# EAGLE board snc98_main_cpu (EAGLE 7.7.0), part 1 of 8
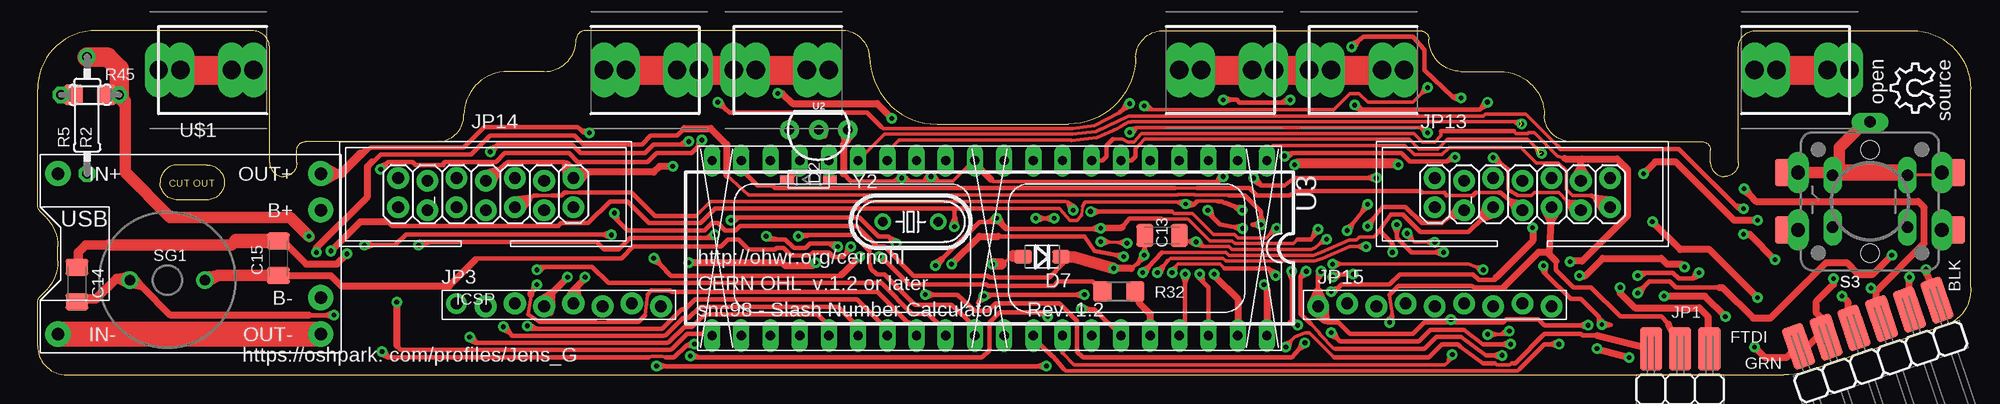
[diagram p3: board, top side]
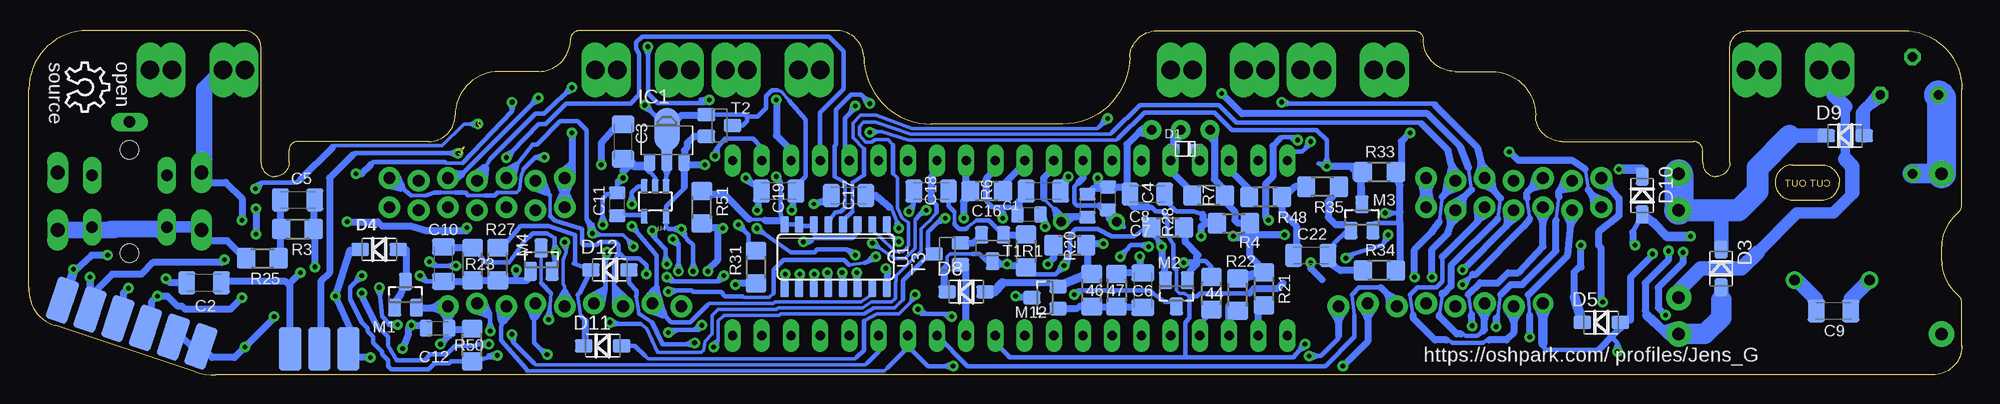
[diagram p4: board, bottom side, seen from below]

Size 168.15 x 29.97 mm. Coordinates in mm from the lower left corner, seen from the top.
Outline: 0.25,14.22 0.76,13.72 arc-42 1.78,11.18 1.78,9.91 arc-42 0.76,7.37 0.25,6.86 arc46 0,6.22 0,2.54 arc90 2.54,0 151.89,0 arc16 153.67,0.25 165.86,4.32 arc77 168.15,7.62 168.15,24.89 arc90 163.07,29.97 149.35,29.97 arc90 147.96,28.45 147.96,18.49 arc-90 146.74,17.27 arc-90 145.52,18.49 145.52,19.56 arc90 144.76,20.32 133.35,20.32 arc-90 131.06,22.61 arc90 127.25,26.42 123.83,26.42 arc-90 121.03,29.21 arc90 120.27,29.97 98.04,29.97 arc90 95.5,27.69 arc-90 89.66,21.84 78.23,21.84 arc-90 72.39,27.69 arc90 69.85,29.97 47.62,29.97 arc90 46.86,29.21 arc-90 44.07,26.42 40.89,26.42 arc90 37.08,22.61 arc-90 34.8,20.32 23.32,20.32 arc90 22.55,19.56 22.55,18.49 arc-90 21.41,17.27 arc-90 20.19,18.49 20.19,28.45 arc90 18.67,29.97 5.08,29.97 arc90 0,24.89 0,14.86
Outline: 0.25,14.22 arc-46 0,14.86
Outline: 0.25,14.22 arc-46 0,14.86
Outline: 14.73,18.29 arc-90 16.26,16.76 arc-90 14.73,15.24 12.19,15.24 arc-90 10.67,16.76 arc-90 12.19,18.29 14.73,18.29
Copper layers (1*16): Top 0.035mm / dielectric 1.5mm / Bottom 0.035mm
Design rules "OSHPark-8mil-2layer *": minimum track width 11mil, minimum drill 15mil, track to track 8mil, track to pad 8mil, pad to pad 8mil, via to via 8mil, smd to smd 8mil, copper to edge 8mil, drill to drill 8mil, minimum pad ring 12mil, minimum via ring 10mil, stop-mask expansion 4mil, vias tented up to drill 20mil, thermal gap 10mil
Net classes: 0 default: clearance 0.205 mm; 1 vcc: width 0.254 mm

## Footprints (pad centres in the part's own frame; a part is rotated, then mirrored left to right if it is on the bottom)
R1206 = smd 1.6 x 1.803: 1 -1.422,0; 2 1.422,0
BATTERY-AAA-LEFT = drill 1.6 long: P1 -2.413,0; P2 3.937,0; P3 2.032,0; P4 -4.318,0
BATTERY-AAA-RIGHT = drill 1.6 long: M1 -3.937,0; M2 2.413,0; M3 4.318,0; M4 -2.032,0
C1206K = smd 1.5 x 2: 1 -1.5,0; 2 1.5,0
C0805K = smd 1.1 x 1.4: 1 -1,0; 2 1,0
0805 = smd 1.1 x 1.4: 3 -1,0; 4 1,0
SOD-323 = smd 1 x 0.8: A -1,0; C 1,0
SOD-123 = smd 1.2 x 0.7: A 1.85,0; C -1.85,0
SOD-123F = smd 1.524 x 1.143: A 1.651,0; C -1.651,0
SOT89 = smd 1 x 1.5: 1 -1.499,-1.981; 3 1.499,-1.981 | smd 1 x 2: 2 0,-1.727 | smd 2.2 x 3.7: 2@1 0,0.94
2X3_SMD_VERTICAL = smd 1.93 x 3.81 bottom: 1 0,1.016; 3 2.54,1.016; 5 5.08,1.016 | smd 1.93 x 3.81: 4 2.54,1.016; 6 5.08,1.016; P$1 0,1.016
1X08-CLEANBIG = drill 1.016 pad 1.778: 1 -8.89,0.127 | drill 1.016 pad 1.93: 2 -6.35,-0.127; 3 -3.81,0.127; 4 -1.27,-0.127; 5 1.27,0.127; 6 3.81,-0.127; 7 6.35,0.127; 8 8.89,-0.127
1X06_LOCK = smd 1.93 x 3.81: P1 0,3.556; P2 2.54,3.556; P3 5.08,3.556; P4 7.62,3.556; P5 10.16,3.556; P6 12.7,3.556 | smd 1.93 x 3.81 bottom: P1A 0,3.556; P2A 2.54,3.556; P3A 5.08,3.556; P4A 7.62,3.556; P5A 10.16,3.556; P6A 12.7,3.556
2X07 = drill 1.016 pad 1.88: 1 -7.62,-1.143; 2 -7.62,1.397; 3 -5.08,-1.397; 4 -5.08,1.143; 5 -2.54,-1.143; 6 -2.54,1.397; 7 0,-1.397; 8 0,1.143; 9 2.54,-1.143; 10 2.54,1.397; 11 5.08,-1.397; 12 5.08,1.143; 13 7.62,-1.143; 14 7.62,1.397
1X09-BIG = drill 1.016 pad 1.88: 1 -10.16,-0.127; 2 -7.62,0.127; 3 -5.08,-0.127; 4 -2.54,0.127; 5 0,-0.127; 6 2.54,0.127; 7 5.08,-0.127; 8 7.62,0.127; 9 10.16,-0.127
SOT-23 = smd 1.143 x 1.524: 1 0.953,1.143; 2 -0.953,1.143; 3 0,-1.143
SOT-23' = smd 1.143 x 1.651: 1 0.94,1.016; 2 -0.94,1.016; 3 0.025,-1.016
0204/5 = drill 0.813 octagon: 1 -2.54,0; 2 2.54,0
0207/10 = drill 0.813 octagon: 1 -5.08,0; 2 5.08,0
TACTILE-PTH-12MM = smd 2.3 x 2.4: P$1 7.1,-2.5; P$2 -7.1,-2.5; P$3 7.1,2.5; P$4 -7.1,2.5 | drill 1.2 long: P$11 6.25,-2.5; P$12 -6.25,-2.5; P$13 6.25,2.5; P$14 -6.25,2.5 | drill 1 long: P$15 0,-6.9; P$21 3.251,-2.248; P$22 -3.251,-2.248; P$23 3.251,2.248; P$24 -3.251,2.248 | hole 1.6: 0,4.5; 0,-4.5; 0,4.5; 0,-4.5
BUZZER-12MM-NS = drill 0.9: + 3.25,0; - -3.25,0
SOT23-BEC = smd 1.143 x 1.524: B -0.953,-1.143; C 0,1.143; E 0.953,-1.143
SOT23-R_INFINEON = smd 0.8 x 0.9: 1 -1,-1.1; 2 1,-1.1; 3 0,1.1 | smd 1.143 x 1.524: B -0.95,-1.143; C 0,1.143; E 0.95,-1.143
SO16 = smd 0.711 x 1.422: 1 -4.445,-2.8; 2 -3.175,-2.8; 3 -1.905,-2.8; 4 -0.635,-2.8; 5 0.635,-2.8; 6 1.905,-2.8; 7 3.175,-2.8; 8 4.445,-2.8; 9 4.445,2.8; 10 3.175,2.8; 11 1.905,2.8; 12 0.635,2.8; 13 -0.635,2.8; 14 -1.905,2.8; 15 -3.175,2.8; 16 -4.445,2.8
TO-92-AMMO = drill 0.813 pad 1.676: 1 -2.54,0; 2 0,0; 3 2.54,0
DIP254P1524X483-40 = drill 0.813 long: 1 -15.24,48.26; 2 -15.24,45.72; 3 -15.24,43.18; 4 -15.24,40.64; 5 -15.24,38.1; 6 -15.24,35.56; 7 -15.24,33.02; 8 -15.24,30.48; 9 -15.24,27.94; 10 -15.24,25.4; 11 -15.24,22.86; 12 -15.24,20.32; 13 -15.24,17.78; 14 -15.24,15.24; 15 -15.24,12.7; 16 -15.24,10.16; 17 -15.24,7.62; 18 -15.24,5.08; 19 -15.24,2.54; 20 -15.24,0; 21 0,0; 22 0,2.54; 23 0,5.08; 24 0,7.62; 25 0,10.16; 26 0,12.7; 27 0,15.24; 28 0,17.78; 29 0,20.32; 30 0,22.86; 31 0,25.4; 32 0,27.94; 33 0,30.48; 34 0,33.02; 35 0,35.56; 36 0,38.1; 37 0,40.64; 38 0,43.18; 39 0,45.72; 40 0,48.26
SOT23-5 = smd 0.635 x 1.27: 1 -0.95,-1.3; 2 0,-1.3; 3 0.95,-1.3; 4 0.95,1.3; 5 -0.95,1.3
BATTERY-CHARGER-LI-PROT = drill 1.1 pad 2.184: B+ 10.668,3.81; B- 10.668,-3.81; IN+ -12.192,6.985; IN- -12.192,-6.985; OUT+ 10.668,6.985; OUT- 10.668,-6.985
SOT89' = smd 0.559 x 1.194: GND -1.499,-0.597; VIN 0,-0.597; VOUT 1.499,-0.597 | smd 1.829 x 0.457: P$4 0,2.743
HC49U-V = drill 0.813: 1 -2.413,0; 2 2.413,0

## Placement (x,y rotation side)
44  22k  [R1206]  65.28,7.11 270 bottom
46  47k  [R1206]  75.69,7.37 270 bottom
47  22k  [R1206]  73.53,7.37 90 bottom
BH7  HOLDER_AAA_LEFT1  [BATTERY-AAA-LEFT]  153.29,26.54 180 top
BH8  HOLDER_AAA_RIGHT  [BATTERY-AAA-RIGHT]  14.86,26.54 180 top
BH9  HOLDER_AAA_LEFT1  [BATTERY-AAA-LEFT]  114.94,26.54 0 top
BH10  HOLDER_AAA_RIGHT  [BATTERY-AAA-RIGHT]  53.21,26.54 0 top
BH11  HOLDER_AAA_LEFT1  [BATTERY-AAA-LEFT]  103.25,26.54 180 top
BH12  HOLDER_AAA_RIGHT  [BATTERY-AAA-RIGHT]  64.9,26.54 180 top
C1  220nF  [C1206K]  79.91,16 0 bottom
C2  220nF  [C1206K]  152.91,8.03 180 bottom
C3  4µ7  [C1206K]  116.46,20.32 270 bottom
C4  1µ  [C1206K]  70.87,15.75 180 bottom
C5  47n  [C1206K]  144.78,15.24 0 bottom
C6  15n  [C1206K]  71.25,7.37 90 bottom
C7  22pF  [C0805K]  76.07,14.73 90 bottom
C8  22pF  [C0805K]  74.3,15.37 90 bottom
C9  1µ  [C1206K]  11.18,5.59 180 bottom
C10  15n  [C1206K]  132.08,9.65 90 bottom
C11  1n  [0805]  116.97,14.86 90 bottom
C12  220n  [0805]  132.59,4.06 180 bottom
C13  47n  [C1206K]  97.82,12.14 180 top
C14  1µ  [C1206K]  3.43,7.87 90 top
C15  1µ  [C1206K]  20.96,10.16 90 top
C16  220nF  [0805]  81.15,13.97 0 bottom
C17  1µ  [C1206K]  96.85,15.62 180 bottom
C18  220n  [C1206K]  89.66,16 180 bottom
C19  1µ  [C1206K]  102.92,16 180 bottom
C22  15n  [C1206K]  56.64,10.41 0 bottom
D1  SD103CW  [SOD-323]  67.56,19.69 0 bottom
D2  SD103CW  [SOD-123]  67.06,17.02 0 top
D3  SD103CW  [SOD-123F]  20.96,9.27 270 bottom
D4  SD103CW  [SOD-123F]  137.67,10.92 0 bottom
D5  SD103CW  [SOD-123F]  31.37,4.57 0 bottom
D7  SD103CW  [SOD-123F]  87.38,10.29 180 top
D8  SD103CW  [SOD-123F]  86.61,7.24 0 bottom
D9  SD103CW  [SOD-123F]  10.16,20.83 0 bottom
D10  SD103CW  [SOD-123F]  27.81,15.62 270 bottom
D11  SD103CW  [SOD-123F]  118.24,2.54 0 bottom
D12  SD103CW  [SOD-123F]  117.6,9.14 0 bottom
IC1  MCP170333MB  [SOT89]  112.65,20.45 0 bottom
JP1  ICSP  [2X3_SMD_VERTICAL]  140.34,1.27 0 top
JP3  [1X08-CLEANBIG]  45.34,6.1 0 top
JP6  FTDI  [1X06_LOCK]  154.31,-0.89 18.5 top
JP13  [2X07]  129.16,15.75 0 top
JP14  [2X07]  38.99,15.75 0 top
JP15  [1X09-BIG]  121.54,6.1 0 top
LOGO1  OSHW_LOGO_8MILX0150-NT  [OSHW_8X150_NOTEXT]  164.95,27.18 270 bottom
LOGO2  OSHW_LOGO_8MILX0150-NT  [OSHW_8X150_NOTEXT]  165,22.86 90 top
M1  IRLML2244  [SOT-23]  135.38,6.98 180 bottom
M2  IRLML2244  [SOT-23]  68.33,7.11 0 bottom
M3  IRLML2244  [SOT-23]  52.2,13.72 180 bottom
M4  IRLML6244  [SOT-23']  123.57,10.03 180 bottom
M12  IRLML2244  [SOT-23]  79.76,6.73 270 bottom
R1  47k  [R1206]  81.41,10.79 90 bottom
R2  150R  [0204/5]  4.57,24.38 180 top
R3  6k8  [R1206]  144.78,12.7 180 bottom
R4  47  [R1206]  63.37,13.21 180 bottom
R5  150R  [0207/10]  4.32,22.61 270 top
R6  22k  [R1206]  84.84,16 0 bottom
R7  6k8  [R1206]  65.53,15.62 0 bottom
R20  1k  [R1206]  77.6,11.3 180 bottom
R21  6k8  [R1206]  60.71,7.49 270 bottom
R22  6k8  [R1206]  62.99,6.98 270 bottom
R23  6k8  [R1206]  129.54,9.65 270 bottom
R25  47  [R1206]  147.83,10.16 180 bottom
R27  6k8  [R1206]  127.36,9.65 270 bottom
R28  47k  [R1206]  69.09,12.83 0 bottom
R31  150  [R1206]  104.9,9.4 90 bottom
R32  150  [R1206]  94.06,7.26 0 top
R33  6k8  [R1206]  50.67,17.65 0 bottom
R34  6k8  [R1206]  50.67,9.09 0 bottom
R35  3k3  [R1206]  55.63,16.38 0 bottom
R45  150R  [R1206]  4.57,24.38 180 top
R48  3k3  [R1206]  60.58,15.49 0 bottom
R50  6k8  [R1206]  129.59,2.62 270 bottom
R51  3k3  [R1206]  109.6,14.61 270 bottom
S3  B3F-4150  [TACTILE-PTH-12MM]  159.39,15.11 180 top
SG1  SBT1205-3  [BUZZER-12MM-NS]  11.3,8.25 180 top
T1  BCR135  [SOT23-BEC]  84.33,11.05 180 bottom
T2  BCR135  [SOT23-BEC]  108.08,21.72 270 bottom
T3  BCR185  [SOT23-R_INFINEON]  88.27,10.54 90 bottom
U1  74HC4051_MUX  [SO16]  97.97,10.29 180 bottom
U2  DS18B20  [TO-92-AMMO]  67.95,21.34 180 top
U3  ATMEGA1284P-PU  [DIP254P1524X483-40]  58.67,3.43 270 top
U4  TLV70033 / TC1185  [SOT23-5]  113.67,15.11 180 bottom
U$1  BATTERY-CHARGER-LI-PROT  [BATTERY-CHARGER-LI-PROT]  13.97,10.54 0 top
U$3  HT7333 / TS9011SCY  [SOT89']  112.65,19.05 0 bottom
Y2  12MHz  [HC49U-V]  75.95,13.34 0 top

## Tracks (layer width: path | path; a pad name or v marks a point on that pad's centre or on a via)
/RESET  (via drill 0.41)
  Top 0.305: 128.25,1.02 128.07,0.89 126.87,0.89 126.75,1.02 | 108.46,2.41 109.07,3.01 | 109.07,3.01 109.37,3.3 110.26,3.68 110.62,3.68 112.78,1.52 | v108.58,2.41 108.45,2.69 109.03,2.97 108.88,2.34 v108.58,2.41 | 109.07,3.01 arc-29 108.44,2.68 | 109.07,3.01 arc29 108.88,2.33 | 109.07,3.01 arc-29 108.44,2.68 | 109.07,3.01 arc29 108.88,2.33 | 109.07,3.01 arc-29 108.44,2.68 | 109.07,3.01 arc29 108.88,2.33 | 109.07,3.01 arc-29 108.44,2.68 | 109.07,3.01 arc29 108.88,2.33 | 109.07,3.01 arc-29 108.44,2.68 | 109.07,3.01 arc29 108.88,2.33 | 109.07,3.01 arc-29 108.44,2.68 | 109.07,3.01 arc29 108.88,2.33 | 109.07,3.01 arc-29 108.44,2.68 | 109.07,3.01 arc29 108.88,2.33 | 109.07,3.01 arc-29 108.44,2.68 | 109.07,3.01 arc29 108.88,2.33 | 109.07,3.01 arc-29 108.44,2.68 | v108.58,2.41 108.44,2.68 | 109.07,3.01 arc29 108.88,2.33 | v108.58,2.41 108.88,2.33 | 109.07,3.01 arc-29 108.44,2.68 | 109.07,3.01 arc29 108.88,2.33 | 109.07,3.01 arc-29 108.44,2.68 | 109.07,3.01 arc29 108.88,2.33 | 109.07,3.01 arc-29 108.44,2.68 | 109.07,3.01 arc29 108.88,2.33 | 109.07,3.01 arc-29 108.44,2.68 | v108.58,2.41 108.44,2.68 | 109.07,3.01 arc29 108.88,2.33 | v108.58,2.41 108.88,2.33
  Top 0.406: v108.58,2.41 108.46,2.41 | 128.25,1.02 128.52,1.02 131.06,3.56 134.24,3.56 134.37,3.43 135.64,3.43 | 112.78,1.52 121.03,1.52 122.17,2.67 123.55,2.67 123.75,2.46 | 126.75,1.02 125.73,1.02 123.75,2.46 | 123.75,2.46 123.55,2.61 | v88.44,13.64 87.73,13.64 | 87.73,13.64 87.67,13.64 | 87.67,13.64 | 87.67,13.64 | 87.67,13.64 87.59,13.64 | 87.59,13.64 | 87.59,13.64 87.53,13.64 | 87.53,13.64 v86.82,13.64 | 87.73,13.64 88.35,13.4 v88.44,13.64 | 87.73,13.64 88.35,13.88 v88.44,13.64 | 87.53,13.64 86.91,13.88 v86.82,13.64 | 87.53,13.64 86.91,13.4 v86.82,13.64 | 87.67,13.64 arc-29 88.36,13.4 | 87.67,13.64 arc29 88.36,13.88 | 87.59,13.64 arc-29 86.9,13.88 | 87.59,13.64 arc29 86.9,13.4 | 87.67,13.64 arc-29 88.36,13.4 | 87.67,13.64 arc29 88.36,13.88 | 87.67,13.64 arc-29 88.36,13.4 | 87.67,13.64 arc29 88.36,13.88 | 87.67,13.64 arc-29 88.36,13.4 | 87.67,13.64 arc29 88.36,13.88 | 87.59,13.64 arc-29 86.9,13.88 | 87.59,13.64 arc29 86.9,13.4 | 87.59,13.64 arc-29 86.9,13.88 | 87.59,13.64 arc29 86.9,13.4 | 87.59,13.64 arc-29 86.9,13.88 | 87.59,13.64 arc29 86.9,13.4 | 87.67,13.64 arc-29 88.36,13.4 | 87.67,13.64 arc29 88.36,13.88 | 87.67,13.64 arc-29 88.36,13.4 | 87.67,13.64 arc29 88.36,13.88 | 87.67,13.64 arc-29 88.36,13.4 | 87.67,13.64 arc29 88.36,13.88 | 87.67,13.64 arc-29 88.36,13.4 | 87.67,13.64 arc29 88.36,13.88 | 87.67,13.64 arc-29 88.36,13.4 | 87.67,13.64 arc29 88.36,13.88 | 87.67,13.64 arc-29 88.36,13.4 | 87.67,13.64 arc29 88.36,13.88 | 87.67,13.64 arc-29 88.36,13.4 | v88.44,13.64 88.36,13.4 | 87.67,13.64 arc29 88.36,13.88 | v88.44,13.64 88.36,13.88 | 87.67,13.64 arc-29 88.36,13.4 | 87.67,13.64 arc29 88.36,13.88 | 87.67,13.64 arc-29 88.36,13.4 | v88.44,13.64 88.36,13.4
  Top 0.406: 87.67,13.64 arc29 88.36,13.88 | v88.44,13.64 88.36,13.88 | v86.82,13.64 87.01,13.8 | v86.82,13.64 86.77,13.39 | 87.59,13.64 arc-29 86.9,13.88 | 87.59,13.64 arc29 86.9,13.4 | 87.59,13.64 arc-29 86.9,13.88 | 87.59,13.64 arc29 86.9,13.4 | 87.59,13.64 arc-29 86.9,13.88 | 87.59,13.64 arc29 86.9,13.4 | 87.59,13.64 arc-29 86.9,13.88 | 87.59,13.64 arc29 86.9,13.4 | 87.59,13.64 arc-29 86.9,13.88 | 87.59,13.64 arc29 86.9,13.4 | 87.59,13.64 arc-29 86.9,13.88 | v86.82,13.64 86.9,13.88 | 87.59,13.64 arc29 86.9,13.4 | v86.82,13.64 86.9,13.4
  Top 0.61: 135.64,3.43 JP1.P$1
  Bottom 0.305: 92.1,6.58 92.84,5.84 94.61,5.84 95.5,5.33 102.74,5.33 102.87,5.21 107.7,5.21 108.2,4.7 108.2,3.08 | 108.2,3.08 | 108.2,3.08 108.2,3.01 | 108.2,3.01 108.46,2.67 | 108.2,3.01 108.28,2.38 v108.58,2.41 | 108.2,3.01 108.75,2.67 v108.58,2.41 | 108.2,3.08 arc-29 108.28,2.38 | 108.2,3.08 arc29 108.77,2.66 | 108.2,3.08 arc-29 108.28,2.38 | 108.2,3.08 arc29 108.77,2.66 | 108.2,3.08 arc-29 108.28,2.38 | 108.2,3.08 arc29 108.77,2.66 | 108.2,3.08 arc-29 108.28,2.38 | 108.2,3.08 arc29 108.77,2.66 | 108.2,3.08 arc-29 108.28,2.38 | 108.2,3.08 arc29 108.77,2.66 | 108.2,3.08 arc-29 108.28,2.38 | 108.2,3.08 arc29 108.77,2.66 | 108.2,3.08 arc-29 108.28,2.38 | 108.2,3.08 arc29 108.77,2.66 | 108.2,3.08 arc-29 108.28,2.38 | v108.58,2.41 108.28,2.38 | 108.2,3.08 arc29 108.77,2.66 | v108.58,2.41 108.77,2.66 | 108.2,3.08 arc-29 108.28,2.38 | 108.2,3.08 arc29 108.77,2.66 | 108.2,3.08 arc-29 108.28,2.38 | v108.58,2.41 108.28,2.38 | 108.2,3.08 arc29 108.77,2.66 | v108.58,2.41 108.77,2.66
  Bottom 0.406: 108.46,2.67 v108.58,2.41 | 92.1,6.58 92.1,8.23 89.92,10.41 89.53,10.41 T3.C 89.92,11.05 89.92,12.45 89.11,13.25 | 86.26,15.6 R6.1 86.26,16.54 | 89.11,13.25 89.07,13.3 | 89.07,13.3 88.72,13.64 v88.44,13.64 | 89.07,13.3 88.64,13.8 v88.44,13.64 | 89.07,13.3 88.41,13.39 v88.44,13.64 | 89.11,13.25 arc-29 88.64,13.8 | 89.11,13.25 arc29 88.39,13.39 | 89.11,13.25 arc-29 88.64,13.8 | 89.11,13.25 arc29 88.39,13.39 | 89.11,13.25 arc-29 88.64,13.8 | 89.11,13.25 arc29 88.39,13.39 | 89.11,13.25 arc-29 88.64,13.8 | 89.11,13.25 arc29 88.39,13.39 | 89.11,13.25 arc-29 88.64,13.8 | 89.11,13.25 arc29 88.39,13.39 | 89.11,13.25 arc-29 88.64,13.8 | 89.11,13.25 arc29 88.39,13.39 | 89.11,13.25 arc-29 88.64,13.8 | 89.11,13.25 arc29 88.39,13.39 | 89.11,13.25 arc-29 88.64,13.8 | 89.11,13.25 arc29 88.39,13.39 | 89.11,13.25 arc-29 88.64,13.8 | v88.44,13.64 88.64,13.8 | 89.11,13.25 arc29 88.39,13.39 | v88.44,13.64 88.39,13.39 | 89.11,13.25 arc-29 88.64,13.8 | 89.11,13.25 arc29 88.39,13.39 | 89.11,13.25 arc-29 88.64,13.8 | 89.11,13.25 arc29 88.39,13.39 | 89.11,13.25 arc-29 88.64,13.8 | 89.11,13.25 arc29 88.39,13.39 | 89.11,13.25 arc-29 88.64,13.8 | v88.44,13.64 88.64,13.8 | 89.11,13.25 arc29 88.39,13.39 | v88.44,13.64 88.39,13.39
  Bottom 0.61: 86.26,16.54 86.61,16.89 U3.9 | 86.87,13.69 v86.82,13.64 86.87,13.72 86.87,15.11 86.26,15.6
A0  (via drill 0.41)
  Top 0.61: v106.68,7.87 106.68,7.75 106.93,7.49 U3.40
  Bottom 0.61: R31.1 106.58,7.98 v106.68,7.87
A1  (via drill 0.41)
  Top 0.61: v102.36,8.76 102.36,8.64 104.39,6.6 U3.39
  Bottom 0.406: U1.9 102.36,7.44 102.36,7.99 | 102.36,7.99 | 102.36,7.99 | 102.36,7.99 102.36,8.05 | 102.36,8.05 v102.36,8.76 | 102.36,8.05 102.6,8.67 v102.36,8.76 | 102.36,8.05 102.12,8.67 v102.36,8.76 | 102.36,7.99 arc-29 102.6,8.68 | 102.36,7.99 arc29 102.12,8.68 | 102.36,7.99 arc-29 102.6,8.68 | 102.36,7.99 arc29 102.12,8.68 | 102.36,7.99 arc-29 102.6,8.68 | 102.36,7.99 arc29 102.12,8.68 | 102.36,7.99 arc-29 102.6,8.68 | 102.36,7.99 arc29 102.12,8.68 | 102.36,7.99 arc-29 102.6,8.68 | 102.36,7.99 arc29 102.12,8.68 | 102.36,7.99 arc-29 102.6,8.68 | 102.36,7.99 arc29 102.12,8.68 | 102.36,7.99 arc-29 102.6,8.68 | 102.36,7.99 arc29 102.12,8.68 | 102.36,7.99 arc-29 102.6,8.68 | 102.36,7.99 arc29 102.12,8.68 | 102.36,7.99 arc-29 102.6,8.68 | 102.36,7.99 arc29 102.12,8.68 | 102.36,7.99 arc-29 102.6,8.68 | 102.36,7.99 arc29 102.12,8.68 | 102.36,7.99 arc-29 102.6,8.68 | v102.36,8.76 102.6,8.68 | 102.36,7.99 arc29 102.12,8.68 | v102.36,8.76 102.12,8.68 | 102.36,7.99 arc-29 102.6,8.68 | 102.36,7.99 arc29 102.12,8.68 | 102.36,7.99 arc-29 102.6,8.68 | v102.36,8.76 102.6,8.68 | 102.36,7.99 arc29 102.12,8.68 | v102.36,8.76 102.12,8.68
A2  (via drill 0.41)
  Top 0.406: v101.09,8.76 101.09,8.38 101.37,8.11 | 101.37,8.11 101.41,8.06 | 101.41,8.06 101.85,7.62 U3.38 | 101.37,8.11 101.35,8.77 v101.09,8.76 | 101.37,8.11 100.91,8.59 | 100.91,8.59 | 100.91,8.59 v101.09,8.76 | 101.41,8.06 arc-29 101.34,8.79 | 101.41,8.06 arc29 100.91,8.59 | 101.41,8.06 arc-29 101.34,8.79 | 101.41,8.06 arc29 100.91,8.59 | 101.41,8.06 arc-29 101.34,8.79 | 101.41,8.06 arc29 100.91,8.59 | 101.41,8.06 arc-29 101.34,8.79 | 101.41,8.06 arc29 100.91,8.59 | 101.41,8.06 arc-29 101.34,8.79 | 101.41,8.06 arc29 100.91,8.59 | 101.41,8.06 arc-29 101.34,8.79 | 101.41,8.06 arc29 100.91,8.59 | 101.41,8.06 arc-29 101.34,8.79 | 101.41,8.06 arc29 100.91,8.59 | 101.41,8.06 arc-29 101.34,8.79 | 101.41,8.06 arc29 100.91,8.59 | 101.41,8.06 arc-29 101.34,8.79 | 101.41,8.06 arc29 100.91,8.59 | 101.41,8.06 arc-29 101.34,8.79 | 101.41,8.06 arc29 100.91,8.59 | v101.09,8.76 100.91,8.59 | 101.41,8.06 arc-29 101.34,8.79 | v101.09,8.76 101.34,8.79 | 101.41,8.06 arc29 100.91,8.59 | v101.09,8.76 100.91,8.59 | 101.41,8.06 arc-29 101.34,8.79 | 101.41,8.06 arc29 100.91,8.59 | 101.41,8.06 arc-29 101.34,8.79 | v101.09,8.76 101.34,8.79 | 101.41,8.06 arc29 100.91,8.59 | v101.09,8.76 100.91,8.59
  Bottom 0.406: U1.10 101.09,7.44 101.09,7.99 | 101.09,7.99 | 101.09,7.99 | 101.09,7.99 101.09,8.05 | 101.09,8.05 v101.09,8.76 | 101.09,8.05 101.33,8.67 v101.09,8.76 | 101.09,8.05 100.86,8.67 v101.09,8.76 | 101.09,7.99 arc-29 101.33,8.68 | 101.09,7.99 arc29 100.85,8.68 | 101.09,7.99 arc-29 101.33,8.68 | 101.09,7.99 arc29 100.85,8.68 | 101.09,7.99 arc-29 101.33,8.68 | 101.09,7.99 arc29 100.85,8.68 | 101.09,7.99 arc-29 101.33,8.68 | 101.09,7.99 arc29 100.85,8.68 | 101.09,7.99 arc-29 101.33,8.68 | 101.09,7.99 arc29 100.85,8.68 | 101.09,7.99 arc-29 101.33,8.68 | 101.09,7.99 arc29 100.85,8.68 | 101.09,7.99 arc-29 101.33,8.68 | 101.09,7.99 arc29 100.85,8.68 | 101.09,7.99 arc-29 101.33,8.68 | 101.09,7.99 arc29 100.85,8.68 | 101.09,7.99 arc-29 101.33,8.68 | 101.09,7.99 arc29 100.85,8.68 | 101.09,7.99 arc-29 101.33,8.68 | 101.09,7.99 arc29 100.85,8.68 | 101.09,7.99 arc-29 101.33,8.68 | v101.09,8.76 101.33,8.68 | 101.09,7.99 arc29 100.85,8.68 | v101.09,8.76 100.85,8.68 | 101.09,7.99 arc-29 101.33,8.68 | 101.09,7.99 arc29 100.85,8.68 | 101.09,7.99 arc-29 101.33,8.68 | v101.09,8.76 101.33,8.68 | 101.09,7.99 arc29 100.85,8.68 | v101.09,8.76 100.85,8.68
A3  (via drill 0.41)
  Top 0.406: v99.82,8.76 99.82,8.05 | 99.82,8.05 99.82,7.99 | 99.82,7.99 | 99.82,7.99 | 99.82,7.99 99.82,3.94 U3.37 | 99.82,8.05 100.06,8.67 v99.82,8.76 | 99.82,8.05 99.58,8.67 v99.82,8.76 | 99.82,7.99 arc-29 100.06,8.68 | 99.82,7.99 arc29 99.58,8.68 | 99.82,7.99 arc-29 100.06,8.68 | 99.82,7.99 arc29 99.58,8.68 | 99.82,7.99 arc-29 100.06,8.68 | 99.82,7.99 arc29 99.58,8.68 | 99.82,7.99 arc-29 100.06,8.68 | 99.82,7.99 arc29 99.58,8.68 | 99.82,7.99 arc-29 100.06,8.68 | 99.82,7.99 arc29 99.58,8.68 | 99.82,7.99 arc-29 100.06,8.68 | 99.82,7.99 arc29 99.58,8.68 | 99.82,7.99 arc-29 100.06,8.68 | 99.82,7.99 arc29 99.58,8.68 | 99.82,7.99 arc-29 100.06,8.68 | 99.82,7.99 arc29 99.58,8.68 | 99.82,7.99 arc-29 100.06,8.68 | 99.82,7.99 arc29 99.58,8.68 | 99.82,7.99 arc-29 100.06,8.68 | 99.82,7.99 arc29 99.58,8.68 | 99.82,7.99 arc-29 100.06,8.68 | v99.82,8.76 100.06,8.68 | 99.82,7.99 arc29 99.58,8.68 | v99.82,8.76 99.58,8.68 | 99.82,7.99 arc-29 100.06,8.68 | 99.82,7.99 arc29 99.58,8.68 | 99.82,7.99 arc-29 100.06,8.68 | v99.82,8.76 100.06,8.68 | 99.82,7.99 arc29 99.58,8.68 | v99.82,8.76 99.58,8.68
  Bottom 0.406: U1.11 99.82,7.44 99.82,7.99 | 99.82,7.99 | 99.82,7.99 | 99.82,7.99 99.82,8.05 | 99.82,8.05 v99.82,8.76 | 99.82,8.05 100.06,8.67 v99.82,8.76 | 99.82,8.05 99.58,8.67 v99.82,8.76 | 99.82,7.99 arc-29 100.06,8.68 | 99.82,7.99 arc29 99.58,8.68 | 99.82,7.99 arc-29 100.06,8.68 | 99.82,7.99 arc29 99.58,8.68 | 99.82,7.99 arc-29 100.06,8.68 | 99.82,7.99 arc29 99.58,8.68 | 99.82,7.99 arc-29 100.06,8.68 | 99.82,7.99 arc29 99.58,8.68 | 99.82,7.99 arc-29 100.06,8.68 | 99.82,7.99 arc29 99.58,8.68 | 99.82,7.99 arc-29 100.06,8.68 | 99.82,7.99 arc29 99.58,8.68 | 99.82,7.99 arc-29 100.06,8.68 | 99.82,7.99 arc29 99.58,8.68 | 99.82,7.99 arc-29 100.06,8.68 | 99.82,7.99 arc29 99.58,8.68 | 99.82,7.99 arc-29 100.06,8.68 | 99.82,7.99 arc29 99.58,8.68 | 99.82,7.99 arc-29 100.06,8.68 | 99.82,7.99 arc29 99.58,8.68 | 99.82,7.99 arc-29 100.06,8.68 | v99.82,8.76 100.06,8.68 | 99.82,7.99 arc29 99.58,8.68 | v99.82,8.76 99.58,8.68 | 99.82,7.99 arc-29 100.06,8.68 | 99.82,7.99 arc29 99.58,8.68 | 99.82,7.99 arc-29 100.06,8.68 | v99.82,8.76 100.06,8.68 | 99.82,7.99 arc29 99.58,8.68 | v99.82,8.76 99.58,8.68
A4
  Top 0.61: R32.2 95.86,6.25 96.77,5.33 U3.36
  Top 0.813: 96.8,3.45 U3.36
A5  (via drill 0.41)
  Top 0.305: v126.14,3.53 126.85,3.53 | 126.85,3.53 126.91,3.53 | 126.91,3.53 127.16,3.53 | 127.16,3.53 127.17,3.53 | 127.17,3.53 127.3,3.53 | 127.3,3.53 | 127.3,3.53 127.36,3.53 | 127.36,3.53 127.99,3.53 v128.02,3.81 | 126.85,3.53 126.27,3.81 v126.14,3.53 | 126.85,3.53 126.27,3.25 v126.14,3.53 | 127.36,3.53 128,3.5 v128.02,3.81 | 127.36,3.53 127.79,4.01 v128.02,3.81 | 127.16,3.53 arc-29 126.26,3.81 | 127.16,3.53 arc29 126.26,3.25 | 127.17,3.53 arc-29 128,3.5 | 127.17,3.53 arc29 127.8,4.03 | 127.16,3.53 arc-29 126.26,3.81 | 127.16,3.53 arc29 126.26,3.25 | 126.91,3.53 arc-29 126.26,3.81 | 126.91,3.53 arc29 126.26,3.25 | 127.16,3.53 arc-29 126.26,3.81 | 127.16,3.53 arc29 126.26,3.25 | 127.17,3.53 arc-29 128,3.5 | 127.17,3.53 arc29 127.8,4.03 | 127.3,3.53 arc-29 128,3.5 | 127.3,3.53 arc29 127.8,4.03 | 127.17,3.53 arc-29 128,3.5 | 127.17,3.53 arc29 127.8,4.03 | v126.14,3.53 126.02,3.25 | v126.14,3.53 126.02,3.81 | 126.91,3.53 arc-29 126.26,3.81 | 126.91,3.53 arc29 126.26,3.25 | 127.16,3.53 arc-29 126.26,3.81 | 127.16,3.53 arc29 126.26,3.25 | 126.91,3.53 arc-29 126.26,3.81 | 126.91,3.53 arc29 126.26,3.25 | 127.16,3.53 arc-29 126.26,3.81 | 127.16,3.53 arc29 126.26,3.25 | 126.91,3.53 arc-29 126.26,3.81 | 126.91,3.53 arc29 126.26,3.25 | 127.16,3.53 arc-29 126.26,3.81 | v126.14,3.53 126.26,3.81 | 127.16,3.53 arc29 126.26,3.25 | v126.14,3.53 126.26,3.25 | 127.17,3.53 arc-29 128,3.5 | 127.17,3.53 arc29 127.8,4.03 | 127.3,3.53 arc-29 128,3.5 | 127.3,3.53 arc29 127.8,4.03 | 127.17,3.53 arc-29 128,3.5 | 127.17,3.53 arc29 127.8,4.03 | 127.3,3.53 arc-29 128,3.5 | 127.3,3.53 arc29 127.8,4.03 | 127.17,3.53 arc-29 128,3.5 | 127.17,3.53 arc29 127.8,4.03 | 127.3,3.53 arc-29 128,3.5
  Top 0.305: 127.3,3.53 arc29 127.8,4.03 | 127.3,3.53 arc-29 128,3.5 | v128.02,3.81 128,3.5 | 127.3,3.53 arc29 127.8,4.03 | v128.02,3.81 127.8,4.03 | 127.3,3.53 arc-29 128,3.5 | 127.3,3.53 arc29 127.8,4.03 | 127.17,3.53 arc-29 128,3.5 | v128.02,3.81 128,3.5 | 127.17,3.53 arc29 127.8,4.03 | v128.02,3.81 127.8,4.03
  Top 0.406: v56.77,1.65 56.9,1.52 57.78,1.52 | 57.78,1.52 82.17,1.52 82.8,2.16 82.8,4.57 83.69,5.46 87.21,5.46 | 87.21,5.46 | 87.21,5.46 | 87.21,5.46 87.28,5.46 | 87.28,5.46 87.5,5.46 v87.88,5.08 | v90.8,5.71 91.52,5.71 | 91.52,5.71 91.58,5.71 | 91.58,5.71 | 91.58,5.71 91.95,5.71 U3.35 | v56.77,1.65 56.9,1.87 | v56.77,1.65 56.82,1.4 | 87.28,5.46 87.68,4.93 v87.88,5.08 | 87.28,5.46 87.93,5.33 v87.88,5.08 | 91.52,5.71 90.9,5.95 v90.8,5.71 | 91.52,5.71 90.9,5.48 v90.8,5.71 | 57.78,1.52 arc-29 56.89,1.87 | 57.78,1.52 arc29 56.81,1.4 | 87.21,5.46 arc-29 87.69,4.91 | 87.21,5.46 arc29 87.93,5.33 | 91.58,5.71 arc-29 90.89,5.96 | 91.58,5.71 arc29 90.89,5.47 | 57.78,1.52 arc-29 56.89,1.87 | 57.78,1.52 arc29 56.81,1.4 | 87.21,5.46 arc-29 87.69,4.91 | 87.21,5.46 arc29 87.93,5.33 | 87.21,5.46 arc-29 87.69,4.91 | 87.21,5.46 arc29 87.93,5.33 | 87.21,5.46 arc-29 87.69,4.91 | 87.21,5.46 arc29 87.93,5.33 | 91.58,5.71 arc-29 90.89,5.96 | 91.58,5.71 arc29 90.89,5.47 | 91.58,5.71 arc-29 90.89,5.96 | 91.58,5.71 arc29 90.89,5.47 | 91.58,5.71 arc-29 90.89,5.96 | 91.58,5.71 arc29 90.89,5.47 | v56.77,1.65 56.69,1.41 | v56.77,1.65 56.69,1.89 | v56.77,1.65 56.89,1.87 | v56.77,1.65 56.81,1.4 | 87.21,5.46 arc-29 87.69,4.91 | 87.21,5.46 arc29 87.93,5.33 | 87.21,5.46 arc-29 87.69,4.91 | 87.21,5.46 arc29 87.93,5.33 | 87.21,5.46 arc-29 87.69,4.91 | 87.21,5.46 arc29 87.93,5.33 | 87.21,5.46 arc-29 87.69,4.91 | 87.21,5.46 arc29 87.93,5.33 | 87.21,5.46 arc-29 87.69,4.91 | 87.21,5.46 arc29 87.93,5.33 | v87.88,5.08 87.93,5.33 | 87.21,5.46 arc-29 87.69,4.91 | 87.21,5.46 arc29 87.93,5.33 | 87.21,5.46 arc-29 87.69,4.91 | 87.21,5.46 arc29 87.93,5.33 | 87.21,5.46 arc-29 87.69,4.91 | 87.21,5.46 arc29 87.93,5.33
  Top 0.406: 87.21,5.46 arc-29 87.69,4.91 | v87.88,5.08 87.69,4.91 | 87.21,5.46 arc29 87.93,5.33 | v87.88,5.08 87.93,5.33 | v90.8,5.71 90.85,5.46 | v90.8,5.71 90.61,5.88 | 91.58,5.71 arc-29 90.89,5.96 | 91.58,5.71 arc29 90.89,5.47 | 91.58,5.71 arc-29 90.89,5.96 | 91.58,5.71 arc29 90.89,5.47 | 91.58,5.71 arc-29 90.89,5.96 | 91.58,5.71 arc29 90.89,5.47 | 91.58,5.71 arc-29 90.89,5.96 | 91.58,5.71 arc29 90.89,5.47 | 91.58,5.71 arc-29 90.89,5.96 | 91.58,5.71 arc29 90.89,5.47 | 91.58,5.71 arc-29 90.89,5.96 | v90.8,5.71 90.89,5.96 | 91.58,5.71 arc29 90.89,5.47 | v90.8,5.71 90.89,5.47
  Bottom 0.305: 95.25,1.02 95.38,0.89 124.08,0.89 124.21,1.02
  Bottom 0.406: 54.23,3.43 54.23,3.17 55.75,1.65 56,1.65 | 56,1.65 | 56,1.65 | 56,1.65 56.06,1.65 | 56.06,1.65 v56.77,1.65 | 94.23,3.17 U3.35 94.23,2.03 95.25,1.02 | v87.88,5.08 88.14,5.08 88.39,5.33 | 88.39,5.33 88.55,5.33 | 88.55,5.33 88.61,5.33 | 88.61,5.33 | 88.61,5.33 90.13,5.33 | 90.13,5.33 90.2,5.33 | 90.2,5.33 90.55,5.33 v90.8,5.71 | v128.02,3.81 128.02,4.52 | 128.02,4.52 128.02,4.58 | 128.02,4.58 | 128.02,4.58 128.02,5.08 128.15,5.22 | 128.15,5.22 128.26,5.33 JP15.8 | 124.21,1.02 125.97,2.78 | 125.97,2.78 125.98,2.79 125.98,2.84 | 125.98,2.84 125.98,3.38 v126.14,3.53 | 56.06,1.65 56.68,1.41 v56.77,1.65 | 56.06,1.65 56.68,1.89 v56.77,1.65 | 125.98,2.84 126.35,3.39 v126.14,3.53 | 125.98,2.84 125.89,3.49 v126.14,3.53 | 88.39,5.33 87.88,5.33 | 88.55,5.33 88.05,4.89 v87.88,5.08 | 90.2,5.33 90.86,5.47 v90.8,5.71 | 90.2,5.33 90.6,5.87 v90.8,5.71 | 128.02,4.52 127.78,3.9 v128.02,3.81 | 128.02,4.52 128.25,3.9 v128.02,3.81 | 56,1.65 arc-29 56.69,1.41 | 56,1.65 arc29 56.69,1.89 | 125.97,2.78 arc-29 126.35,3.4 | 125.97,2.78 arc29 125.88,3.5 | 88.61,5.33 arc-29 87.88,5.33 | 88.61,5.33 arc29 88.04,4.88 | 90.13,5.33 arc-29 90.85,5.46 | 90.13,5.33 arc29 90.61,5.88 | 128.02,4.58 arc-29 127.78,3.89 | 128.02,4.58 arc29 128.26,3.89 | 128.15,5.22 arc-29 129.34,5.51 | 128.15,5.22 arc29 128.44,6.4 | 56,1.65 arc-29 56.69,1.41 | 56,1.65 arc29 56.69,1.89 | 56,1.65 arc-29 56.69,1.41 | 56,1.65 arc29 56.69,1.89 | 56,1.65 arc-29 56.69,1.41 | 56,1.65 arc29 56.69,1.89 | 125.97,2.78 arc-29 126.35,3.4 | 125.97,2.78 arc29 125.88,3.5 | 125.97,2.78 arc-29 126.35,3.4 | 125.97,2.78 arc29 125.88,3.5 | 125.97,2.78 arc-29 126.35,3.4 | 125.97,2.78 arc29 125.88,3.5 | 88.61,5.33 arc-29 87.88,5.33
  Bottom 0.406: 88.61,5.33 arc29 88.04,4.88 | 88.61,5.33 arc-29 87.88,5.33 | 88.61,5.33 arc29 88.04,4.88 | 88.61,5.33 arc-29 87.88,5.33 | 88.61,5.33 arc29 88.04,4.88 | 90.13,5.33 arc-29 90.85,5.46 | 90.13,5.33 arc29 90.61,5.88 | 90.13,5.33 arc-29 90.85,5.46 | 90.13,5.33 arc29 90.61,5.88 | 90.13,5.33 arc-29 90.85,5.46 | 90.13,5.33 arc29 90.61,5.88 | 128.02,4.58 arc-29 127.78,3.89 | 128.02,4.58 arc29 128.26,3.89 | 128.02,4.58 arc-29 127.78,3.89 | 128.02,4.58 arc29 128.26,3.89 | 128.02,4.58 arc-29 127.78,3.89 | 128.02,4.58 arc29 128.26,3.89 | 128.15,5.22 arc-29 129.34,5.51 | 128.15,5.22 arc29 128.44,6.4 | 128.15,5.22 arc-29 129.34,5.51 | 128.15,5.22 arc29 128.44,6.4 | 128.15,5.22 arc-29 129.34,5.51 | 128.15,5.22 arc29 128.44,6.4 | 56,1.65 arc-29 56.69,1.41 | 56,1.65 arc29 56.69,1.89 | 56,1.65 arc-29 56.69,1.41 | 56,1.65 arc29 56.69,1.89 | 56,1.65 arc-29 56.69,1.41 | 56,1.65 arc29 56.69,1.89 | 56,1.65 arc-29 56.69,1.41 | 56,1.65 arc29 56.69,1.89 | 56,1.65 arc-29 56.69,1.41 | 56,1.65 arc29 56.69,1.89 | 56,1.65 arc-29 56.69,1.41 | 56,1.65 arc29 56.69,1.89 | 56,1.65 arc-29 56.69,1.41 | v56.77,1.65 56.69,1.41 | 56,1.65 arc29 56.69,1.89 | v56.77,1.65 56.69,1.89 | 56,1.65 arc-29 56.69,1.41 | 56,1.65 arc29 56.69,1.89 | 56,1.65 arc-29 56.69,1.41 | v56.77,1.65 56.69,1.41 | 56,1.65 arc29 56.69,1.89 | v56.77,1.65 56.69,1.89 | 125.97,2.78 arc-29 126.35,3.4 | 125.97,2.78 arc29 125.88,3.5 | 125.97,2.78 arc-29 126.35,3.4 | 125.97,2.78 arc29 125.88,3.5 | 125.97,2.78 arc-29 126.35,3.4 | 125.97,2.78 arc29 125.88,3.5 | 125.88,3.5 | 125.97,2.78 arc-29 126.35,3.4 | 125.97,2.78 arc29 125.88,3.5 | v126.14,3.53 125.88,3.5 | 125.97,2.78 arc-29 126.35,3.4 | v126.14,3.53 126.35,3.4 | 125.97,2.78 arc29 125.88,3.5
  Bottom 0.406: v126.14,3.53 125.88,3.5 | v87.88,5.08 87.69,4.91 | v87.88,5.08 87.93,5.33 | 88.61,5.33 arc-29 87.88,5.33 | 88.61,5.33 arc29 88.04,4.88 | 88.61,5.33 arc-29 87.88,5.33 | 88.61,5.33 arc29 88.04,4.88 | 88.61,5.33 arc-29 87.88,5.33 | 88.61,5.33 arc29 88.04,4.88 | 88.61,5.33 arc-29 87.88,5.33 | v87.88,5.08 87.88,5.33 | 88.61,5.33 arc29 88.04,4.88 | v87.88,5.08 88.04,4.88 | 90.13,5.33 arc-29 90.85,5.46 | 90.13,5.33 arc29 90.61,5.88 | 90.13,5.33 arc-29 90.85,5.46 | 90.13,5.33 arc29 90.61,5.88 | 90.13,5.33 arc-29 90.85,5.46 | 90.13,5.33 arc29 90.61,5.88 | 90.13,5.33 arc-29 90.85,5.46 | 90.13,5.33 arc29 90.61,5.88 | 90.13,5.33 arc-29 90.85,5.46 | 90.13,5.33 arc29 90.61,5.88 | 90.13,5.33 arc-29 90.85,5.46 | 90.13,5.33 arc29 90.61,5.88 | 90.13,5.33 arc-29 90.85,5.46 | 90.13,5.33 arc29 90.61,5.88 | 90.13,5.33 arc-29 90.85,5.46 | 90.13,5.33 arc29 90.61,5.88 | v90.8,5.71 90.61,5.88 | 90.13,5.33 arc-29 90.85,5.46 | v90.8,5.71 90.85,5.46 | 90.13,5.33 arc29 90.61,5.88 | v90.8,5.71 90.61,5.88 | v128.02,3.81 128.03,3.56 | v128.02,3.81 127.85,4 | 128.02,4.58 arc-29 127.78,3.89 | 128.02,4.58 arc29 128.26,3.89 | 128.02,4.58 arc-29 127.78,3.89 | 128.02,4.58 arc29 128.26,3.89 | 128.02,4.58 arc-29 127.78,3.89 | 128.02,4.58 arc29 128.26,3.89 | 128.02,4.58 arc-29 127.78,3.89 | 128.02,4.58 arc29 128.26,3.89 | 128.02,4.58 arc-29 127.78,3.89 | 128.02,4.58 arc29 128.26,3.89 | 128.02,4.58 arc-29 127.78,3.89 | v128.02,3.81 127.78,3.89 | 128.02,4.58 arc29 128.26,3.89 | v128.02,3.81 128.26,3.89 | 128.15,5.22 arc-29 129.34,5.51 | 128.15,5.22 arc29 128.44,6.4 | 128.15,5.22 arc-29 129.34,5.51 | 128.15,5.22 arc29 128.44,6.4 | 128.15,5.22 arc-29 129.34,5.51 | 128.15,5.22 arc29 128.44,6.4
  Bottom 0.406: 128.15,5.22 arc-29 129.34,5.51 | 128.15,5.22 arc29 128.44,6.4 | 128.15,5.22 arc-29 129.34,5.51 | 128.15,5.22 arc29 128.44,6.4 | 128.15,5.22 arc-29 129.34,5.51 | 128.15,5.22 arc29 128.44,6.4 | 128.15,5.22 arc-29 129.34,5.51 | 128.15,5.22 arc29 128.44,6.4 | 128.15,5.22 arc-29 129.34,5.51 | 128.15,5.22 arc29 128.44,6.4 | 128.15,5.22 arc-29 129.34,5.51 | JP15.8 129.34,5.51 | 128.15,5.22 arc29 128.44,6.4 | JP15.8 128.44,6.4
  Bottom 0.61: JP3.8 54.23,4.7 | 54.23,4.7 54.23,4.55 | 54.23,4.55 54.23,3.43 | 54.23,4.7 54.79,5.63 JP3.8 | 54.23,4.7 53.66,5.63 JP3.8 | 54.23,4.55 arc-29 54.81,5.66 | 54.23,4.55 arc29 53.64,5.66 | 54.23,4.55 arc-29 54.81,5.66 | 54.23,4.55 arc29 53.64,5.66 | 54.23,4.55 arc-29 54.81,5.66 | 54.23,4.55 arc29 53.64,5.66 | 54.23,4.55 arc-29 54.81,5.66 | 54.23,4.55 arc29 53.64,5.66 | 54.23,4.55 arc-29 54.81,5.66 | 54.23,4.55 arc29 53.64,5.66 | 54.23,4.55 arc-29 54.81,5.66 | 54.23,4.55 arc29 53.64,5.66 | 54.23,4.55 arc-29 54.81,5.66 | 54.23,4.55 arc29 53.64,5.66 | 54.23,4.55 arc-29 54.81,5.66 | 54.23,4.55 arc29 53.64,5.66 | 54.23,4.55 arc-29 54.81,5.66 | 54.23,4.55 arc29 53.64,5.66 | 54.23,4.55 arc-29 54.81,5.66 | 54.23,4.55 arc29 53.64,5.66 | 54.23,4.55 arc-29 54.81,5.66 | 54.81,5.66 | 54.23,4.55 arc29 53.64,5.66 | 54.23,4.55 arc-29 54.81,5.66 | 54.23,4.55 arc29 53.64,5.66 | JP3.8 53.64,5.66 | 54.23,4.55 arc-29 54.81,5.66 | JP3.8 54.81,5.66 | 54.23,4.55 arc29 53.64,5.66 | JP3.8 53.64,5.66
  Bottom 0.813: 128.26,5.33 129.34,5.72 JP15.8 128.66,6.41 128.26,5.33
A6  (via drill 0.41)
  Top 0.406: v53.85,0.76 54.87,0.76 | 54.87,0.76 86.73,0.76 | 87.05,0.76 86.73,0.76 | 87.05,0.76 87.24,0.76 | 87.24,0.76 v87.76,0.76 | v53.85,0.76 53.94,1 | v53.85,0.76 53.94,0.52 | 87.05,0.76 87.67,0.52 v87.76,0.76 | 87.05,0.76 87.67,1 v87.76,0.76 | 54.87,0.76 arc29 53.93,0.52 | 86.73,0.76 arc-29 87.67,0.52 | 86.73,0.76 arc29 87.67,1 | 54.87,0.76 arc-29 53.93,1 | 54.87,0.76 arc29 53.93,0.52 | 54.87,0.76 arc-29 53.93,1 | 54.87,0.76 arc29 53.93,0.52 | 86.73,0.76 arc-29 87.67,0.52 | 86.73,0.76 arc29 87.67,1 | 86.73,0.76 arc-29 87.67,0.52 | 86.73,0.76 arc29 87.67,1 | 54.87,0.76 arc-29 53.93,1 | 54.87,0.76 arc29 53.93,0.52 | 54.87,0.76 arc-29 53.93,1 | 54.87,0.76 arc29 53.93,0.52 | 54.87,0.76 arc-29 53.93,1 | v53.85,0.76 53.93,1 | v53.85,0.76 53.93,0.52 | 86.73,0.76 arc-29 87.67,0.52 | 86.73,0.76 arc29 87.67,1 | 86.73,0.76 arc-29 87.67,0.52 | 86.73,0.76 arc29 87.67,1 | 86.73,0.76 arc-29 87.67,0.52 | 86.73,0.76 arc29 87.67,1 | 86.73,0.76 arc-29 87.67,0.52 | 86.73,0.76 arc29 87.67,1 | v87.76,0.76 87.67,0.52 | v87.76,0.76 87.67,1 | 87.24,0.76 arc-29 87.67,0.52 | v87.76,0.76 87.67,0.52
  Bottom 0.305: 93.47,0.64 93.73,0.38 124.84,0.38 124.84,0.51
  Bottom 0.406: 93.47,0.64 91.69,2.41 U3.34 91.57,3.43 91.57,2.41 89.92,0.76 88.53,0.76 | 124.84,0.51 127.08,3 127.08,4.14 126.96,4.59 | 126.96,4.59 | 126.96,4.59 | 126.96,4.59 126.93,4.74 JP15.7 | 88.53,0.76 | 88.53,0.76 88.47,0.76 | 88.47,0.76 v87.76,0.76 | 88.47,0.76 87.85,1 v87.76,0.76 | 88.47,0.76 87.85,0.52 v87.76,0.76 | 88.53,0.76 arc-29 87.84,1 | 88.53,0.76 arc29 87.84,0.52 | 126.96,4.59 arc-29 127.32,5.75 | 126.96,4.59 arc29 126.1,5.45 | 88.53,0.76 arc-29 87.84,1 | 88.53,0.76 arc29 87.84,0.52 | 88.53,0.76 arc-29 87.84,1 | 88.53,0.76 arc29 87.84,0.52 | 88.53,0.76 arc-29 87.84,1 | 88.53,0.76 arc29 87.84,0.52 | 126.96,4.59 arc-29 127.32,5.75 | 126.96,4.59 arc29 126.1,5.45 | 126.96,4.59 arc-29 127.32,5.75 | 126.96,4.59 arc29 126.1,5.45 | 126.96,4.59 arc-29 127.32,5.75 | 126.96,4.59 arc29 126.1,5.45 | v87.76,0.76 87.67,0.52 | v87.76,0.76 87.67,1 | 88.53,0.76 arc-29 87.84,1 | 88.53,0.76 arc29 87.84,0.52 | 88.53,0.76 arc-29 87.84,1 | 88.53,0.76 arc29 87.84,0.52 | 88.53,0.76 arc-29 87.84,1 | 88.53,0.76 arc29 87.84,0.52 | 88.53,0.76 arc-29 87.84,1 | 88.53,0.76 arc29 87.84,0.52 | 88.53,0.76 arc-29 87.84,1 | 88.53,0.76 arc29 87.84,0.52 | 88.53,0.76 arc-29 87.84,1 | v87.76,0.76 87.84,1 | 88.53,0.76 arc29 87.84,0.52 | v87.76,0.76 87.84,0.52 | 126.96,4.59 arc-29 127.32,5.75 | 126.96,4.59 arc29 126.1,5.45 | 126.96,4.59 arc-29 127.32,5.75 | 126.96,4.59 arc29 126.1,5.45 | 126.96,4.59 arc-29 127.32,5.75 | 126.96,4.59 arc29 126.1,5.45 | 126.96,4.59 arc-29 127.32,5.75 | 126.96,4.59 arc29 126.1,5.45 | 126.96,4.59 arc-29 127.32,5.75 | 126.96,4.59 arc29 126.1,5.45 | 126.96,4.59 arc-29 127.32,5.75 | 126.96,4.59 arc29 126.1,5.45 | 126.96,4.59 arc-29 127.32,5.75 | 126.96,4.59 arc29 126.1,5.45
  Bottom 0.406: JP15.7 126.1,5.45 | 126.96,4.59 arc-29 127.32,5.75 | JP15.7 127.32,5.75 | 126.96,4.59 arc29 126.1,5.45 | 126.96,4.59 arc-29 127.32,5.75 | JP15.7 127.32,5.75 | 126.96,4.59 arc29 126.1,5.45 | JP15.7 126.1,5.45
  Bottom 0.61: JP3.7 51.69,4.95 | 51.69,4.95 51.69,4.8 | 51.69,4.8 51.69,2.92 v53.85,0.76 | 51.69,4.95 52.25,5.88 JP3.7 | 51.69,4.95 51.12,5.88 JP3.7 | 51.69,4.8 arc-29 52.27,5.92 | 51.69,4.8 arc29 51.1,5.92 | 51.69,4.8 arc-29 52.27,5.92 | 51.69,4.8 arc29 51.1,5.92 | 51.69,4.8 arc-29 52.27,5.92 | 51.69,4.8 arc29 51.1,5.92 | 51.69,4.8 arc-29 52.27,5.92 | 51.69,4.8 arc29 51.1,5.92 | 51.69,4.8 arc-29 52.27,5.92 | 51.69,4.8 arc29 51.1,5.92 | 51.69,4.8 arc-29 52.27,5.92 | 51.69,4.8 arc29 51.1,5.92 | 51.69,4.8 arc-29 52.27,5.92 | 51.69,4.8 arc29 51.1,5.92 | 51.69,4.8 arc-29 52.27,5.92 | 51.69,4.8 arc29 51.1,5.92 | 51.69,4.8 arc-29 52.27,5.92 | 51.69,4.8 arc29 51.1,5.92 | 51.69,4.8 arc-29 52.27,5.92 | 51.69,4.8 arc29 51.1,5.92 | 51.69,4.8 arc-29 52.27,5.92 | 52.27,5.92 | 51.69,4.8 arc29 51.1,5.92 | 51.69,4.8 arc-29 52.27,5.92 | 51.69,4.8 arc29 51.1,5.92 | JP3.7 51.1,5.92 | 51.69,4.8 arc-29 52.27,5.92 | JP3.7 52.27,5.92 | 51.69,4.8 arc29 51.1,5.92 | JP3.7 51.1,5.92
  Bottom 0.813: 126.93,4.74 127.14,5.87 JP15.7 126.2,5.63 126.93,4.74
A7  (via drill 0.41)
  Top 0.305: 122.66,1.12 122.43,0.89 90.17,0.89 89.15,1.91 | 122.66,1.12 122.7,1.16 | 122.7,1.16 122.94,1.4 | 122.7,1.16 123.23,1.53 v123.06,1.78 | 122.7,1.16 122.76,1.8 v123.06,1.78 | 122.66,1.12 arc-29 123.24,1.53 | 122.66,1.12 arc29 122.76,1.82 | 122.66,1.12 arc-29 123.24,1.53 | 122.66,1.12 arc29 122.76,1.82 | 122.66,1.12 arc-29 123.24,1.53 | 122.66,1.12 arc29 122.76,1.82 | 122.66,1.12 arc-29 123.24,1.53 | 122.66,1.12 arc29 122.76,1.82 | 122.66,1.12 arc-29 123.24,1.53 | 122.66,1.12 arc29 122.76,1.82 | 122.66,1.12 arc-29 123.24,1.53 | 122.66,1.12 arc29 122.76,1.82 | 122.66,1.12 arc-29 123.24,1.53 | 122.66,1.12 arc29 122.76,1.82 | 122.66,1.12 arc-29 123.24,1.53 | 122.66,1.12 arc29 122.76,1.82 | 122.66,1.12 arc-29 123.24,1.53 | v123.06,1.78 123.24,1.53 | 122.66,1.12 arc29 122.76,1.82 | 122.66,1.12 arc-29 123.24,1.53 | 122.66,1.12 arc29 122.76,1.82 | 122.66,1.12 arc-29 123.24,1.53 | 122.66,1.12 arc29 122.76,1.82 | 122.66,1.12 arc-29 123.24,1.53 | 122.66,1.12 arc29 122.76,1.82 | 122.66,1.12 arc-29 123.24,1.53 | v123.06,1.78 123.24,1.53 | 122.66,1.12 arc29 122.76,1.82 | v123.06,1.78 122.76,1.82
  Top 0.406: U3.33 89.15,1.91 | 122.94,1.4 123.06,1.65 v123.06,1.78
  Bottom 0.305: 53.09,6.98 52.83,5.21
  Bottom 0.406: 50.55,7.62 52.45,7.62 53.09,6.98 | 52.83,5.21 52.83,3.3 55.37,0.76 86.49,0.76 U3.33 | v123.06,1.78 123.19,1.78 123.62,2.21 | 123.62,2.21 123.67,2.26 | 123.67,2.26 124.21,2.79 124.21,4.81 | 124.21,4.81 | 124.21,4.81 124.21,5.09 123.95,6.1 JP15.6 | 123.62,2.21 122.99,2.02 v123.06,1.78 | 123.62,2.21 123.28,1.65 v123.06,1.78 | 123.67,2.26 arc-29 122.98,2.02 | 123.67,2.26 arc29 123.28,1.64 | 124.21,4.81 arc-29 124.74,5.9 | 124.21,4.81 arc29 123.48,5.79 | 123.67,2.26 arc-29 122.98,2.02 | 123.67,2.26 arc29 123.28,1.64 | 123.67,2.26 arc-29 122.98,2.02 | 123.67,2.26 arc29 123.28,1.64 | 123.67,2.26 arc-29 122.98,2.02 | 123.67,2.26 arc29 123.28,1.64 | 124.21,4.81 arc-29 124.74,5.9 | 124.21,4.81 arc29 123.48,5.79 | 124.21,4.81 arc-29 124.74,5.9 | 124.21,4.81 arc29 123.48,5.79 | 124.21,4.81 arc-29 124.74,5.9 | 124.21,4.81 arc29 123.48,5.79 | 123.67,2.26 arc-29 122.98,2.02 | 123.67,2.26 arc29 123.28,1.64 | 123.67,2.26 arc-29 122.98,2.02 | 123.67,2.26 arc29 123.28,1.64 | 123.67,2.26 arc-29 122.98,2.02 | 123.67,2.26 arc29 123.28,1.64 | 123.67,2.26 arc-29 122.98,2.02 | 123.67,2.26 arc29 123.28,1.64 | 123.67,2.26 arc-29 122.98,2.02 | 123.67,2.26 arc29 123.28,1.64 | 123.67,2.26 arc-29 122.98,2.02 | 123.67,2.26 arc29 123.28,1.64 | v123.06,1.78 123.28,1.64 | 123.67,2.26 arc-29 122.98,2.02 | v123.06,1.78 122.98,2.02 | 123.67,2.26 arc29 123.28,1.64 | v123.06,1.78 123.28,1.64 | 123.67,2.26 arc-29 122.98,2.02 | 123.67,2.26 arc29 123.28,1.64 | 123.67,2.26 arc-29 122.98,2.02 | v123.06,1.78 122.98,2.02 | 123.67,2.26 arc29 123.28,1.64 | v123.06,1.78 123.28,1.64 | 124.21,4.81 arc-29 124.74,5.9 | 124.21,4.81 arc29 123.48,5.79 | 124.21,4.81 arc-29 124.74,5.9
  Bottom 0.406: 124.21,4.81 arc29 123.48,5.79 | 124.21,4.81 arc-29 124.74,5.9 | 124.21,4.81 arc29 123.48,5.79 | 124.21,4.81 arc-29 124.74,5.9 | 124.21,4.81 arc29 123.48,5.79 | 124.21,4.81 arc-29 124.74,5.9 | JP15.6 124.74,5.9 | 124.21,4.81 arc29 123.48,5.79 | JP15.6 123.48,5.79 | 124.21,4.81 arc-29 124.74,5.9 | 124.21,4.81 arc29 123.48,5.79 | 124.21,4.81 arc-29 124.74,5.9 | 124.21,4.81 arc29 123.48,5.79 | JP15.6 123.48,5.79 | 124.21,4.81 arc-29 124.74,5.9 | 124.21,4.81 arc29 123.48,5.79 | 124.21,4.81 arc-29 124.74,5.9 | JP15.6 124.74,5.9 | 124.21,4.81 arc29 123.48,5.79 | JP15.6 123.48,5.79
  Bottom 0.61: JP3.6 49.15,6.22 49.91,6.98 | 49.91,6.98 50.02,7.09 | 50.02,7.09 | 50.02,7.09 50.55,7.62 | JP3.6 48.9,6.58 | 49.91,6.98 49.81,5.91 JP3.6 | 50.02,7.09 arc-29 48.87,6.57 | 50.02,7.09 arc29 49.8,5.85 | 50.02,7.09 arc-29 48.87,6.57 | 50.02,7.09 arc29 49.8,5.85 | 50.02,7.09 arc-29 48.87,6.57 | 50.02,7.09 arc29 49.8,5.85 | 50.02,7.09 arc-29 48.87,6.57 | 50.02,7.09 arc29 49.8,5.85 | 49.76,6.45 arc29 49.24,5.3 JP3.6 | 50.02,7.09 arc-29 48.87,6.57 | 50.02,7.09 arc29 49.8,5.85 | 50.02,7.09 arc-29 48.87,6.57 | 50.02,7.09 arc29 49.8,5.85 | 50.02,7.09 arc-29 48.87,6.57 | 50.02,7.09 arc29 49.8,5.85 | 50.02,7.09 arc-29 48.87,6.57 | JP3.6 48.87,6.57 | 50.02,7.09 arc29 49.8,5.85 | JP3.6 49.8,5.85
  Bottom 0.813: 124.21,5.09 124.54,5.95 JP15.6 123.58,6.05 124.21,5.09
A8
  Bottom 0.61: R35.1 58.04,16.38 58.67,15.75 58.9,15.75 R48.2 59.16,14.2 57.91,12.95 57.91,10.64 C22.1
A9
  Bottom 0.406: 146.3,11.94 146.3,12.6 R3.2 | 146.3,10.67 146.3,10.26 R25.1 | C5.1 146.3,15.24 146.3,14.61
  Bottom 0.61: 146.3,11.94 146.3,10.67 | 146.3,14.61 146.3,12.8 R3.2
AREF_+1V  (via drill 0.41)
  Top 0.305: 88.29,1.6 88.32,1.6 | 89.28,0.51 89.41,0.38 128.78,0.38 128.91,0.51
  Top 0.406: U3.32 86.61,3.17 88.29,1.6 | 88.32,1.6 89.28,0.51 | v132.33,2.67 131.62,2.67 | 131.62,2.67 131.56,2.67 | 131.56,2.67 | 131.56,2.67 | 131.56,2.67 131.06,2.67 128.91,0.51 | 131.62,2.67 132.24,2.43 v132.33,2.67 | 131.62,2.67 132.24,2.9 v132.33,2.67 | 131.56,2.67 arc-29 132.25,2.43 | 131.56,2.67 arc29 132.25,2.91 | 131.56,2.67 arc-29 132.25,2.43 | 131.56,2.67 arc29 132.25,2.91 | 131.56,2.67 arc-29 132.25,2.43 | 131.56,2.67 arc29 132.25,2.91 | 131.56,2.67 arc-29 132.25,2.43 | 131.56,2.67 arc29 132.25,2.91 | 131.56,2.67 arc-29 132.25,2.43 | 131.56,2.67 arc29 132.25,2.91 | 131.56,2.67 arc-29 132.25,2.43 | 131.56,2.67 arc29 132.25,2.91 | 131.56,2.67 arc-29 132.25,2.43 | 131.56,2.67 arc29 132.25,2.91 | 131.56,2.67 arc-29 132.25,2.43 | 131.56,2.67 arc29 132.25,2.91 | 131.56,2.67 arc-29 132.25,2.43 | 131.56,2.67 arc29 132.25,2.91 | 131.56,2.67 arc-29 132.25,2.43 | 131.56,2.67 arc29 132.25,2.91 | 131.56,2.67 arc-29 132.25,2.43 | v132.33,2.67 132.25,2.43 | 131.56,2.67 arc29 132.25,2.91 | v132.33,2.67 132.25,2.91 | 131.56,2.67 arc-29 132.25,2.43 | 131.56,2.67 arc29 132.25,2.91 | 131.56,2.67 arc-29 132.25,2.43 | v132.33,2.67 132.25,2.43 | 131.56,2.67 arc29 132.25,2.91 | v132.33,2.67 132.25,2.91
  Bottom 0.406: 131.7,4.08 C12.3 | 131.57,3.95 131.59,3.95 C12.3 | C12.3 129.79,4.06
  Bottom 0.61: JP15.9 131.7,4.7 | 131.7,4.7 131.7,4.55 | 131.7,4.55 | 131.7,4.55 131.7,4.08 | R50.1 129.94,3.95 131.57,3.95 131.57,3.43 v132.33,2.67 | U3.32 86.61,9.59 T3.B | M1.2 133.12,5.84 | 133.12,5.84 | 133.12,5.84 132.96,5.84 | 132.96,5.84 131.83,5.84 JP15.9 | 131.7,4.7 132.25,5.65 JP15.9 | 131.7,4.7 131.15,5.65 JP15.9 | 132.96,5.84 132.07,6.48 JP15.9 | 132.96,5.84 131.96,5.39 JP15.9 | 131.7,4.55 arc-29 132.27,5.69 | 131.7,4.55 arc29 131.13,5.69 | 133.12,5.84 arc-29 132.03,6.51 | 133.12,5.84 arc29 131.93,5.38 | 131.7,4.55 arc-29 132.27,5.69 | 131.7,4.55 arc29 131.13,5.69 | 133.12,5.84 arc-29 132.03,6.51 | 133.12,5.84 arc29 131.93,5.38 | 131.7,4.55 arc-29 132.27,5.69 | 131.7,4.55 arc29 131.13,5.69 | 131.7,4.55 arc-29 132.27,5.69 | 131.7,4.55 arc29 131.13,5.69 | 133.12,5.84 arc-29 132.03,6.51 | 133.12,5.84 arc29 131.93,5.38 | 133.12,5.84 arc-29 132.03,6.51 | 133.12,5.84 arc29 131.93,5.38 | 131.7,4.55 arc-29 132.27,5.69 | 131.7,4.55 arc29 131.13,5.69 | 131.7,4.55 arc-29 132.27,5.69 | 131.7,4.55 arc29 131.13,5.69 | 131.7,4.55 arc-29 132.27,5.69 | 131.7,4.55 arc29 131.13,5.69 | 131.7,4.55 arc-29 132.27,5.69 | 131.7,4.55 arc29 131.13,5.69 | 133.12,5.84 arc-29 132.03,6.51 | 133.12,5.84 arc29 131.93,5.38 | 133.12,5.84 arc-29 132.03,6.51 | 133.12,5.84 arc29 131.93,5.38 | 131.7,4.55 arc-29 132.27,5.69 | 131.7,4.55 arc29 131.13,5.69 | 131.7,4.55 arc-29 132.27,5.69 | JP15.9 132.27,5.69 | 131.7,4.55 arc29 131.13,5.69 | 133.12,5.84 arc-29 132.03,6.51 | 133.12,5.84 arc29 131.93,5.38 | 133.12,5.84 arc-29 132.03,6.51 | 133.12,5.84 arc29 131.93,5.38 | JP15.9 131.93,5.38 | 131.7,4.55 arc-29 132.27,5.69 | 131.7,4.55 arc29 131.13,5.69 | 131.7,4.55 arc-29 132.27,5.69
  Bottom 0.61: 131.7,4.55 arc29 131.13,5.69 | JP15.9 131.13,5.69 | 131.7,4.55 arc-29 132.27,5.69 | 131.7,4.55 arc29 131.13,5.69 | 131.7,4.55 arc-29 132.27,5.69 | JP15.9 132.27,5.69 | 131.7,4.55 arc29 131.13,5.69 | JP15.9 131.13,5.69 | 133.12,5.84 arc-29 132.03,6.51 | 133.12,5.84 arc29 131.93,5.38 | 133.12,5.84 arc-29 132.03,6.51 | JP15.9 132.03,6.51 | 133.12,5.84 arc29 131.93,5.38 | JP15.9 131.93,5.38
AVCC  (via drill 0.41)
  Top 0.305: 72.36,10.79 72.36,9.7
  Top 0.406: 81.53,4.19 79.5,6.1 76.33,6.1 73.66,8.76 73.03,8.76 72.52,9.22 72.36,9.7 | 66.55,12.19 v66.17,12.06 | 66.55,12.19 66.83,12.19 | 66.83,12.19 66.9,12.19 | 66.9,12.19 | 66.9,12.19 70.99,12.19 71.81,11.38 72.19,10.97 72.36,10.79 | 66.55,12.19 66.17,12.19 | 66.83,12.19 66.21,11.88 v66.17,12.06 | 66.9,12.19 arc-29 66.17,12.19 | 66.9,12.19 arc29 66.2,11.87 | 66.9,12.19 arc-29 66.17,12.19 | 66.9,12.19 arc29 66.2,11.87 | 66.9,12.19 arc-29 66.17,12.19 | 66.9,12.19 arc29 66.2,11.87 | 66.9,12.19 arc-29 66.17,12.19 | 66.9,12.19 arc29 66.2,11.87 | v66.17,12.06 66.92,12.11 | 66.9,12.19 arc-29 66.17,12.19 | 66.9,12.19 arc29 66.2,11.87 | 66.9,12.19 arc-29 66.17,12.19 | 66.9,12.19 arc29 66.2,11.87 | 66.9,12.19 arc-29 66.17,12.19 | 66.9,12.19 arc29 66.2,11.87 | 66.9,12.19 arc-29 66.17,12.19 | v66.17,12.06 66.17,12.19 | 66.9,12.19 arc29 66.2,11.87 | v66.17,12.06 66.2,11.87
  Top 0.61: U3.30 81.53,4.19
  Bottom 0.406: C4.1 69.37,15.26 68.33,14.22 66.8,14.22 66.04,13.97
  Bottom 0.61: v66.17,12.06 66.17,12.95 65.66,13.21 | 65.66,13.21 R4.2 | 66.04,13.97 66.04,13.59 65.66,13.21
B_MINUS
  Top 0.61: BH8.M4 13.34,26.54 | 12.07,26.54 11.94,26.67 12.57,26.67 BH8.M2 13.34,26.54 | 13.46,26.67 17.27,26.67 | 17.27,26.67 17.4,26.54 | 18.03,26.42 17.53,26.42 17.4,26.54 | 18.03,26.42 18.92,26.42 | 18.92,26.42 19.3,26.42 19.18,26.54 BH8.M1 | 18.92,26.42 BH8.M1 | 13.34,26.54 13.46,26.67 | 18.67,26.54 18.8,26.67 17.27,26.67 | 11.43,26.67 11.18,26.67 | 10.92,26.67 11.18,26.67 | 11.18,26.67 11.43,26.92 11.43,26.67 | 11.43,26.67 12.45,26.67 | 13.46,26.67 12.95,26.67 | 12.95,26.67 12.45,26.67 | 12.45,26.67 12.32,26.54 | BH8.M3 10.03,26.54 | 10.03,26.54 9.91,26.67 9.91,26.42 10.03,26.54 | 17.4,26.54 17.91,26.54 | 17.91,26.54 18.03,26.42 | 12.07,26.54 11.43,26.54 | 12.32,26.54 12.07,26.54 | 12.32,26.54 12.83,26.54 | 12.83,26.54 12.95,26.67 | 17.91,26.54 BH8.M1 | 12.83,26.54 17.4,26.54
  Top 2.184: BH8.M3 11.43,26.54 12.32,26.54 | 18.67,26.54 BH8.M4
  Top 2.54: 12.32,26.54 BH8.M2 BH8.M4
  Bottom 0.406: 12.32,26.54 BH8.M2
  Bottom 0.813: 10.16,23.37 10.16,18.8
  Bottom 1.016: 9.53,15.88 9.65,15.62 11.18,14.1 14.35,14.1 17.78,10.67
  Bottom 1.27: U$1.B- 24.64,7.37 22.73,9.27 19.18,9.27 17.78,10.67 | 12.32,26.54 11.18,25.65 11.18,24.38 10.16,23.37 | 10.16,18.8 9.53,18.16 9.53,15.88
CA_PWM  (via drill 0.41)
  Top 0.305: v95,21.13 95.61,21.54 | 120.32,21.54 v120.9,21.08 | 120.36,21.54 120.32,21.54 | 120.32,21.54 120.28,21.54 | 120.28,21.54 95.65,21.54 | 95.65,21.54 95.61,21.54 | 95.58,21.54 95.61,21.54 | 95.58,21.54 94.95,21.43 v95,21.13 | 95.58,21.54 95.26,20.98 v95,21.13 | 120.36,21.54 120.63,20.95 v120.9,21.08 | 120.36,21.54 120.98,21.38 v120.9,21.08 | 95.65,21.54 arc-29 94.95,21.43 | 95.65,21.54 arc29 95.25,20.96 | 120.28,21.54 arc-29 120.64,20.93 | 120.28,21.54 arc29 120.97,21.38 | 95.65,21.54 arc-29 94.95,21.43 | 95.65,21.54 arc29 95.25,20.96 | 95.65,21.54 arc-29 94.95,21.43 | 95.65,21.54 arc29 95.25,20.96 | 95.65,21.54 arc-29 94.95,21.43 | 95.65,21.54 arc29 95.25,20.96 | 120.28,21.54 arc-29 120.64,20.93 | 120.28,21.54 arc29 120.97,21.38 | 120.28,21.54 arc-29 120.64,20.93 | 120.28,21.54 arc29 120.97,21.38 | 120.28,21.54 arc-29 120.64,20.93 | 120.28,21.54 arc29 120.97,21.38 | 95.65,21.54 arc-29 94.95,21.43 | v95,21.13 94.95,21.43 | 95.65,21.54 arc29 95.25,20.96 | v95,21.13 95.25,20.96 | 95.65,21.54 arc-29 94.95,21.43 | 95.65,21.54 arc29 95.25,20.96 | 95.65,21.54 arc-29 94.95,21.43 | 95.65,21.54 arc29 95.25,20.96 | 95.65,21.54 arc-29 94.95,21.43 | v95,21.13 94.95,21.43 | 95.65,21.54 arc29 95.25,20.96 | 95.65,21.54 arc-29 94.95,21.43 | 95.65,21.54 arc29 95.25,20.96 | v95,21.13 95.25,20.96 | 95.65,21.54 arc-29 94.95,21.43 | 95.65,21.54 arc29 95.25,20.96 | 95.65,21.54 arc-29 94.95,21.43 | 95.65,21.54 arc29 95.25,20.96 | v95,21.13 95.25,20.96 | 95.65,21.54 arc-29 94.95,21.43 | 95.65,21.54 arc29 95.25,20.96 | 95.65,21.54 arc-29 94.95,21.43 | v95,21.13 94.95,21.43 | 95.65,21.54 arc29 95.25,20.96 | v95,21.13 95.25,20.96 | 120.28,21.54 arc-29 120.64,20.93
  Top 0.305: 120.28,21.54 arc29 120.97,21.38 | 120.28,21.54 arc-29 120.64,20.93 | 120.28,21.54 arc29 120.97,21.38 | 120.28,21.54 arc-29 120.64,20.93 | 120.28,21.54 arc29 120.97,21.38 | 120.28,21.54 arc-29 120.64,20.93 | 120.28,21.54 arc29 120.97,21.38 | 120.28,21.54 arc-29 120.64,20.93 | v120.9,21.08 120.64,20.93 | 120.28,21.54 arc29 120.97,21.38 | 120.28,21.54 arc-29 120.64,20.93 | 120.28,21.54 arc29 120.97,21.38 | 120.28,21.54 arc-29 120.64,20.93 | 120.28,21.54 arc29 120.97,21.38 | 120.28,21.54 arc-29 120.64,20.93 | 120.28,21.54 arc29 120.97,21.38 | 120.28,21.54 arc-29 120.64,20.93 | v120.9,21.08 120.64,20.93 | 120.28,21.54 arc29 120.97,21.38 | v120.9,21.08 120.97,21.38